# EasyEDA Pro project QV-601-Contril.eprj

# Schematic Schematic1
Board Name: Schematic2; Create Date: 2025-07-12; Page Name: P1; Project Name: QV-601-Contril; Schematic Name: Schematic1; Update Date: 2025-07-12; Company: 嘉立创EDA; Page Size: A4; Version: V1.0
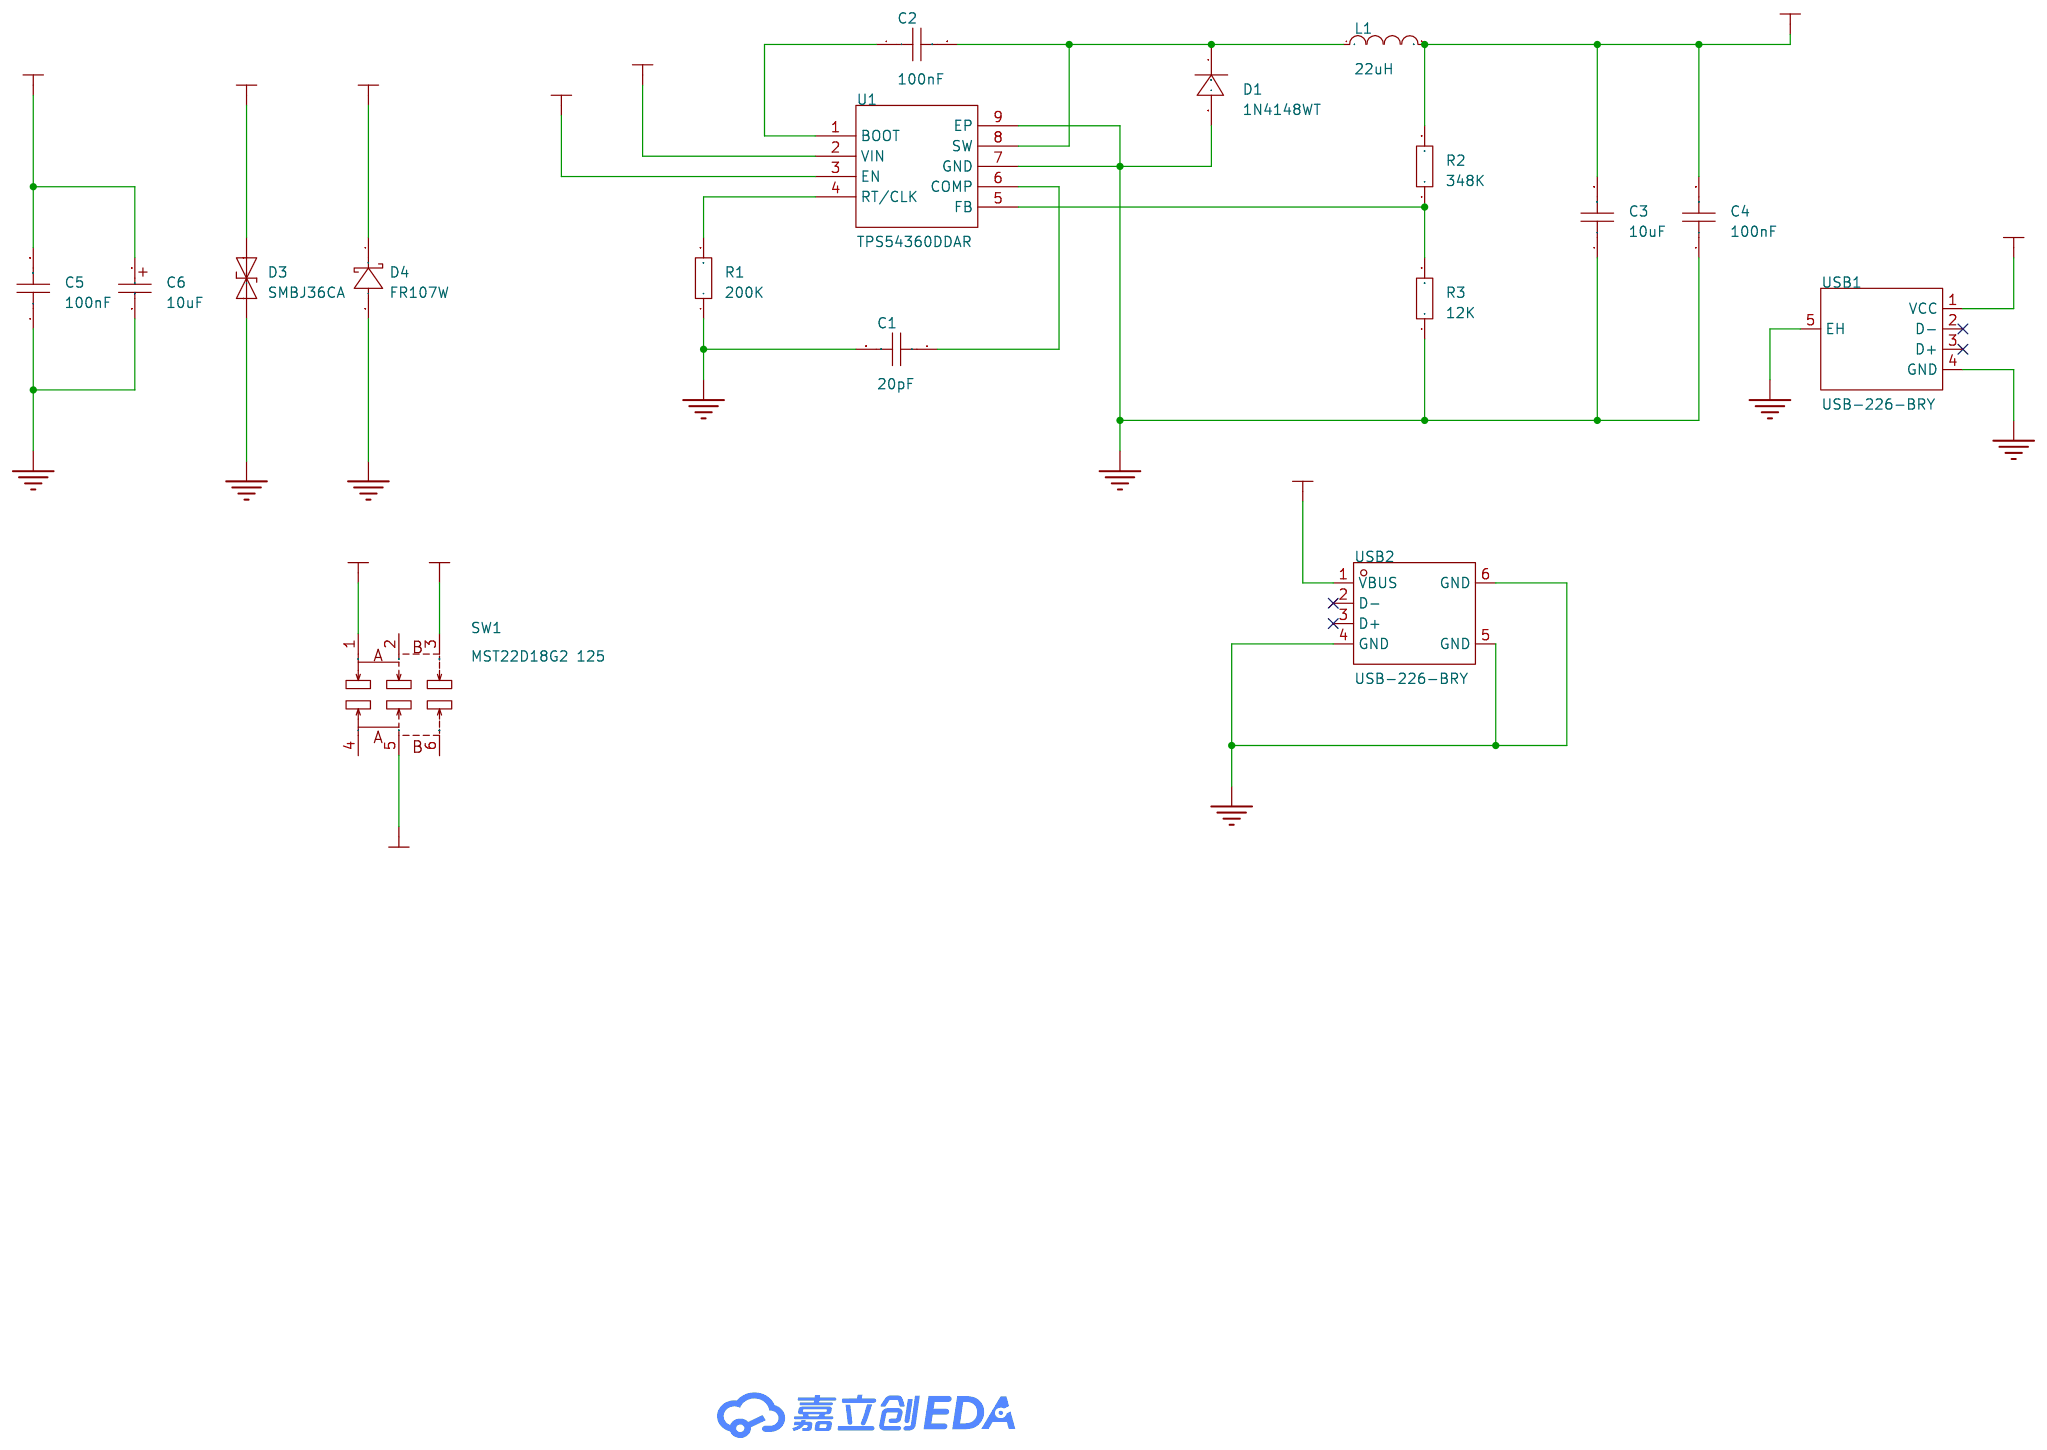
[diagram p0: schematic sheet]

## Parts
C1  20pF  [C0603]
C2  100nF  [C0603]
C3  10uF  [C0603]
C4  100nF  [C0603]
C5  100nF  [C0603]
C6  10uF  [C_Ele_SMD_3x5.4mm]
D1  1N4148WT  [SOD-523_L1.2-W0.8-LS1.6-RD]
D3  SMBJ36CA  [SMB_L4.6-W3.6-LS5.3-BI]
D4  FR107W  [SOD-123FL_L2.7-W1.8-LS3.8-RD]
L1  22uH  [L0603]
R1  200K  [R0603]
R2  348K  [R0603]
R3  12K  [R0603]
SW1  MST22D18G2 125  [SW-SMD_MST22D18G2]
U1  TPS54360DDAR  [SOIC-8_L5.0-W4.0-P1.27-LS6.0-BL-EP2.0]
USB1  USB-226-BRY  [USB-A-TH_USB-226-BRY]
USB2  USB-226-BRY  [USB-A_TH_USB-256-BRWH150]

## Library data of the parts
C1-C5 = CAP_0603: Supplier Footprint: 0603
C6 = C_Ele_SMD_3x5.4mm: Supplier Footprint: SMD,3x5.4mm
D1 = 1N4148WT_C232841: LCSC Part Name: 电压:75V 电流:300mA; Supplier Part: C232841; Manufacturer: onsemi(安森美); Supplier Footprint: SOD-523F; JLCPCB Part Class: 扩展库; Datasheet: https://atta.szlcsc.com/upload/public/pdf/source/20181222/C232841_42C5BA49E5A441BB8F6B91D0F4CD0D51.pdf; Supplier: LCSC; Diode Configuration: 独立式; Forward Voltage (Vf@If): 1V@10mA; Reverse Voltage (Vr): 75V; Rectified Current: 300mA; Reverse Leakage Current: 5uA@75V; Reverse Recovery Time (trr): 4ns; Operating Temperature: -55℃~+150℃@(Tj)
D3 = SMBJ36CA_C83326: Supplier Part: C83326; Manufacturer: Littelfuse(美国力特); Supplier Footprint: SMB(DO-214AA); JLCPCB Part Class: 扩展库; Datasheet: https://atta.szlcsc.com/upload/public/pdf/source/20190807/C409416_D98C874D944FBE9BE31A2BD6B7A21533.pdf; Supplier: LCSC; polarity: 双向; Reverse Stand-Off Voltage (Vrwm): 36V; Maximum Clamping Voltage: 58.1V; Peak Pulse Current (Ipp): 10.4A; Peak Pulse Power Dissipation (Ppp): 600W; Breakdown Voltage: 40V; Type: TVS
D4 = FR107W_C18199114: Supplier Part: C18199114; Manufacturer: 宏嘉诚; Supplier Footprint: SOD-123FL; JLCPCB Part Class: 扩展库; Datasheet: https://atta.szlcsc.com/upload/public/pdf/source/20250116/CFD3D02D7202F2D6A6FEE7AEEDFF5E78.pdf; Supplier: LCSC; Diode Configuration: 独立式; Voltage - Forward(Vf@If): 1.3V@1.0A; Voltage - DC Reverse(Vr): 1kV; Current - Rectified: 1A; Reverse Leakage Current (Ir): 2uA@1000V; Reverse Recovery Time (trr): 500ns; Operating Temperature: -55℃~+150℃
L1 = L_0603
R1-R3 = Res_0603: Supplier Footprint: 0603
SW1 = MST22D18G2 125: LCSC Part Name: 拨动开关/两档立式 6脚贴片 柄长2.0mm 大六立贴 9.1*3.5mm; Supplier Part: C2906280; Manufacturer: SHOU HAN(首韩); Supplier Footprint: SMD; JLCPCB Part Class: 扩展库; Datasheet: https://atta.szlcsc.com/upload/public/pdf/source/20211019/449AD4EDF23AADA7A5C4E3C063EDBB30.pdf; Supplier: LCSC; Circuit: 双刀双掷; Pin Style: 鸥翼型; Mounting Style: 立贴; Actuator Color: 黑色; Current Rating (DC): 100mA; Voltage Rating (DC): 12V; Mechanical Life: 1万次; Operating Temperature: -25℃~+70℃
U1 = TPS54360DDAR: LCSC Part Name: 60V输入、3.5A输出降压DC-DC转换器; Supplier Part: C44377; Manufacturer: TI(德州仪器); Supplier Footprint: SOIC-8-EP; JLCPCB Part Class: 扩展库; Datasheet: https://www.ti.com/cn/lit/gpn/tps54360; Supplier: LCSC; Function: 降压型; Output Type: 可调; Input Voltage: 4.5V~60V; Output Voltage: 800mV~58.8V; Output Current: 3.5A; Switching Frequency: 2.5MHz; Operating Temperature: -40℃~+150℃@(TJ); Synchronous Rectification: 否; Number of Outputs: 1; Topology: 降压式; Switch tube (built-in/external): 内置
USB1 = USB-226-BRY: LCSC Part Name: Type-A 母 侧插; Supplier Part: C720523; Manufacturer: XUNPU(讯普); Supplier Footprint: 插件; JLCPCB Part Class: 扩展库; Datasheet: https://atta.szlcsc.com/upload/public/pdf/source/20250304/9D0DDAB7BEF0F27DF71E5AD865AFBDD8.pdf; Supplier: LCSC; Connector Type: Type-A; Protocol Standard: USB 2.0; Gender: 母; Mounting Type: 侧插; Number of Contacts: 4P; Number of Ports: 1; Current Rating-Power: 1.5A; Operating Temperature: -20℃~+70℃
USB2 = USB-256-BRWH150: LCSC Part Name: Type-A 母 直插; Supplier Part: C720544; Manufacturer: XUNPU(讯普); Supplier Footprint: 插件; JLCPCB Part Class: 扩展库; Datasheet: https://atta.szlcsc.com/upload/public/pdf/source/20200812/C720544_3A01B35EF472B7FB04986893C594DBBE.pdf; Supplier: LCSC; Connector Type: Type-A; Standard: USB 2.0; Gender: 母; Number of Ports: 1; Number of Contacts: 4P; Mounting Style: 直插; Current Rating - Power (Max): 1.5A; Operating Temperature Range: -20℃~+70℃; Soldering Temperature(Max): 260℃

## Nets
GND: C1.2 C3.1 C4.1 C5.1 C6.2 D1.2(A) D3.1(K) D4.2(A) R1.1 R3.1 U1.7(GND) U1.9(EP) USB1.4(GND) USB1.5(EH) USB2.4(GND) USB2.5(GND) USB2.6(GND)
VCC_5V: U1.3(EN) USB1.1(VCC) USB2.1(VBUS)
VCC_24V: C3.2 C4.2 D3.2(A) D4.1(K) L1.2 R2.2 SW1.1 SW1.5
V+: C5.2 C6.1 SW1.3 U1.2(VIN)
$1N372: R1.2 U1.4(RT/CLK)
$1N443: C1.1 U1.6(COMP)
$1N575: C2.1 U1.1(BOOT)
$1N581: C2.2 D1.1(C) L1.1 U1.8(SW)
$1N917: R2.1 R3.2 U1.5(FB)

Not connected (* = marked no-connect by the designer): SW1 2 4 6; USB1 2(D-)* 3(D+)*; USB2 2(D-)* 3(D+)*

# Board QV-601-Contril
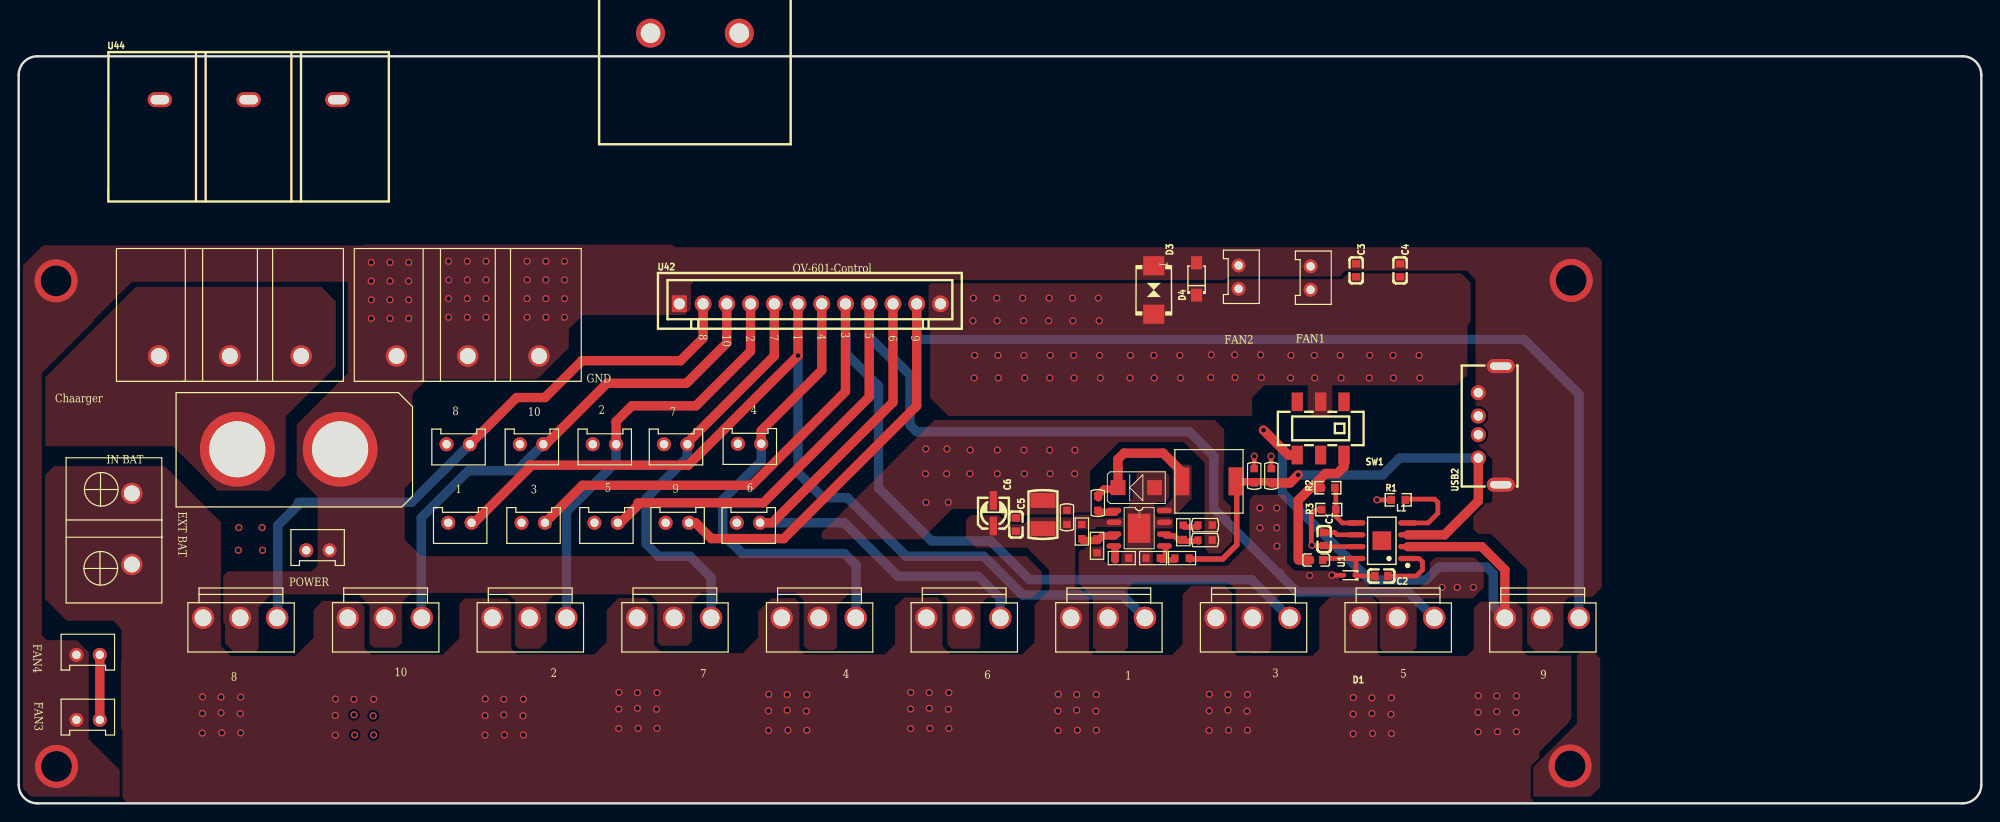
[diagram p1: board, top side]
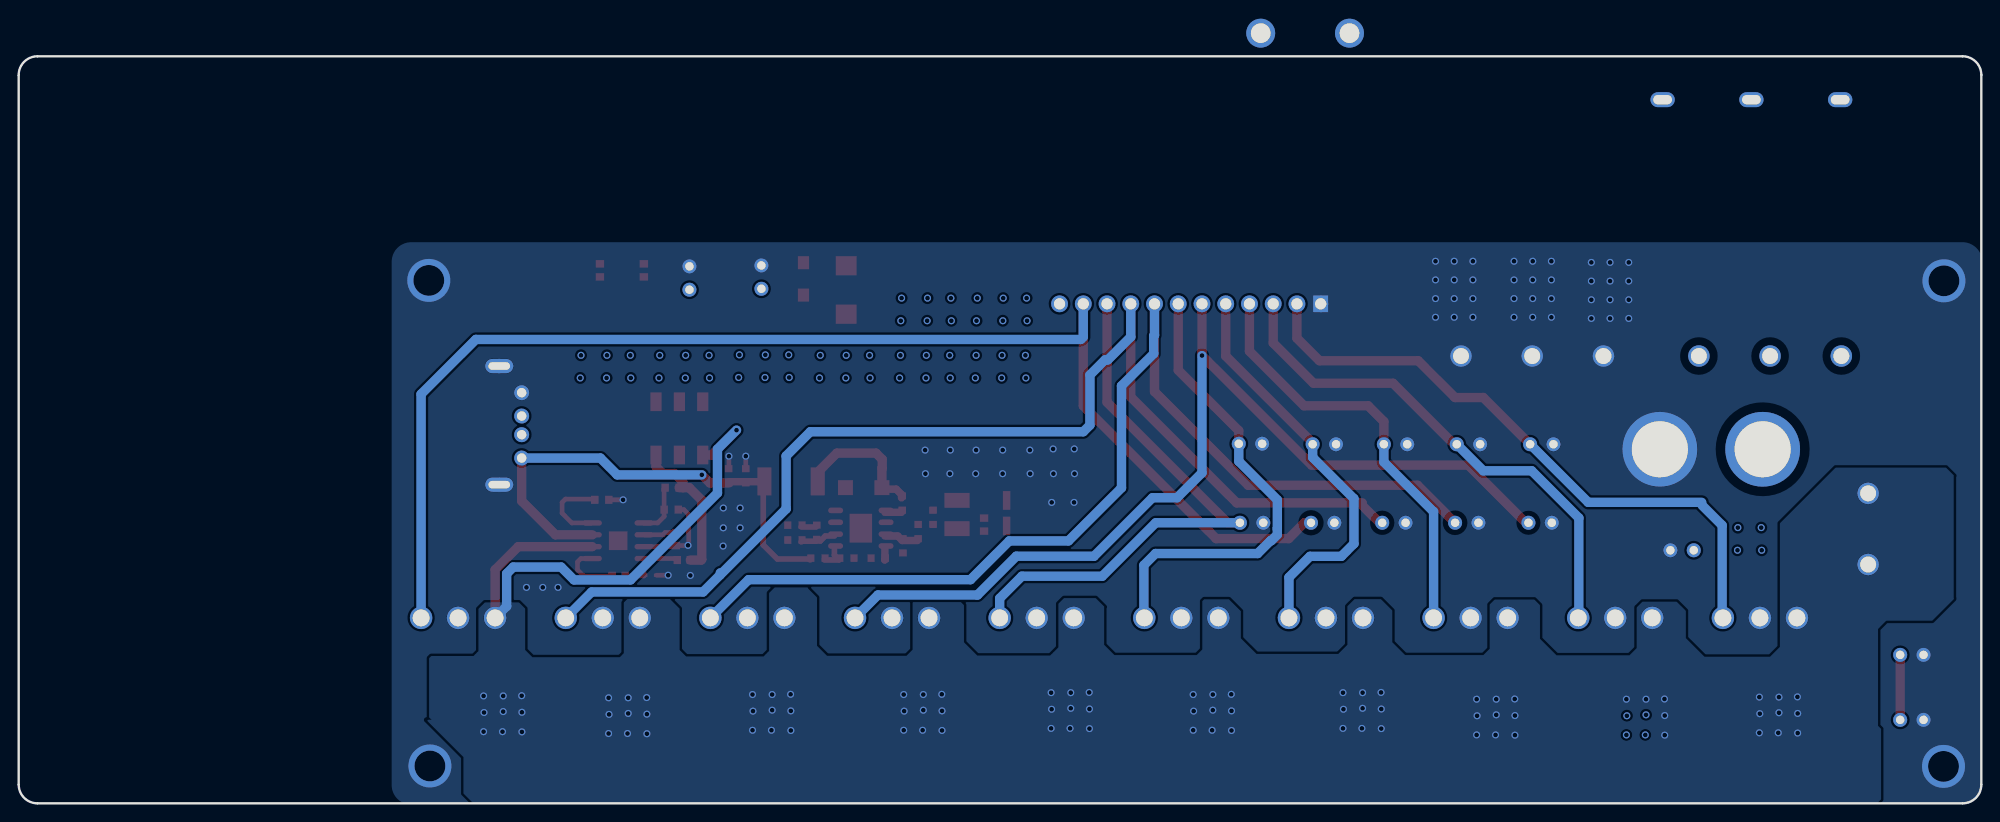
[diagram p2: board, bottom side, seen from below]

Outline 210 x 80 mm; copper layers: Top Layer, Inner1, Inner2, Bottom Layer. Coordinates in mm from the lower left corner of the outline.
Outline path: 0,78 0,2 arc(0.59,0.59) 2,0 208,0 arc(209.41,0.59) 210,2 210,78 arc(209.41,79.41) 208,80 2,80 arc(0.59,79.41) 0,78
Stack: Top Layer 0.035mm 外层铜厚1oz / Dielectric1 0.2104mm 7628 RC49% 8.6mil / Inner1 0.0152mm 内层铜厚 / Dielectric2 1.065mm 1.1mm H/HOZ Copper / Inner2 0.0152mm 内层铜厚 / Dielectric3 0.2104mm 7628 RC49% 8.6mil / Bottom Layer 0.035mm 外层铜厚1oz

## Design rules (mm)
net J1: Top Side Components
net L4: Top Side Components
net R40: Top Side Components
net R38: Top Side Components
net R37: Top Side Components
net R39: Top Side Components
net R36: Top Side Components
net R35: Top Side Components
net D1: Top Side Components
net C56: Top Side Components
net C52: Top Side Components
net C57: Top Side Components
net C54: Top Side Components
net C53: Top Side Components
net C59: Top Side Components
net C58: Top Side Components
net U41: Top Side Components
net U40: Top Side Components
net J9: Top Side Components
net J8: Top Side Components
net J7: Top Side Components
net J6: Top Side Components
net J5: Top Side Components
net J4: Top Side Components
net J3: Top Side Components
net J15: Top Side Components
net J14: Top Side Components
net J13: Top Side Components
net J12: Top Side Components
net J11: Top Side Components
net J10: Top Side Components
net U9: Top Side Components
net U8: Top Side Components
net U7: Top Side Components
net U6: Top Side Components
net U5: Top Side Components
net U12: Top Side Components
net U11: Top Side Components
net U10: Top Side Components
net U2: Top Side Components
net U3: Top Side Components
net U1: Top Side Components
net J2: Top Side Components
net U4: Top Side Components
template: 用户自定义配置
spacing Clearance (default): track to track 0.254, other pairs 0 to 0.254
track width Width (default): min 0.5, default 1, max 2
differential pair DiffPairsRouting (default): width min 0.381, default 0.381, max 0.381; gap min 0.254, default 0.254
via RoutingVias (default): diameter min 0.61, default 0.762, max 4.6; hole min 0.305, default 0.508, max 3.3

## Placement (name value [footprint] x y rotation side)
C1  20pF  [C0603]  139.68 28.3 270 top
C2  100nF  [C0603]  145.8 24.34 180 top
C3  10uF  [C0603]  143.11 57.08 270 top
C4  100nF  [C0603]  147.81 57.08 270 top
C5  100nF  [C0603]  106.7 29.85 270 top
C6  10uF  [C_Ele_SMD_3x5.4mm]  104.31 31.07 270 top
C52  CAP NP_C0603_100NF  [C0603#2]  115.46 32.15 90 top
C53  CAP NP_C0603_10UF/10V  [C0603#2]  134.03 35.08 90 top
C54  CAP NP_C0603_10UF/10V  [C0603#2]  132.2 35.08 90 top
C56  CAP NP_C1210_10UF/50V  [C1210]  109.6 30.93 90 top
C57  CAP NP_C0603_100NF  [C0603#2]  112.16 30.63 90 top
C58  CAP NP_C0603_100NF  [C0603#2]  126.94 28.19 180 top
C59  CAP NP_C0603_100NF  [C0603#2]  126.94 29.79 180 top
D1  1N4148WT  [SMA]  119.58 33.81 180 top
D1#2  -  [SOD-523_L1.2-W0.8-LS1.6-RD]  142.38 24.43 180 top
D3  SMBJ36CA  [SMB_L4.6-W3.6-LS5.3-BI]  121.46 54.98 270 top
D4  FR107W  [SOD-123FL_L2.7-W1.8-LS3.8-RD]  126.03 56.16 90 top
J1  CON2_XT90PBM_XT90PB-M  [XT90PBM]  23.4 37.92 0 top
J2  CON2_DBT50G-7R62-2P1_DBT50G-7.6  [DBT50G-7R62-2P1]  12.11 33.2 270 top
J3  CON2_XH2R54-21_ZX-XH2.54-2PZZ  [XH2R54-21]  8.68 8.94 180 top
J4  CON2_XH2R54-21_ZX-XH2.54-2PZZ  [XH2R54-21]  130.53 55.1 90 top
J5  CON2_XH2R54-21_ZX-XH2.54-2PZZ  [XH2R54-21]  138.23 55 90 top
J6  CON2_XH2R54-21_ZX-XH2.54-2PZZ  [XH2R54-21]  45.78 38.45 0 top
J7  CON2_XH2R54-21_ZX-XH2.54-2PZZ  [XH2R54-21]  53.63 38.45 0 top
J8  CON2_XH2R54-21_ZX-XH2.54-2PZZ  [XH2R54-21]  61.43 38.45 0 top
J9  -  [XH2R54-21]  76.95 38.51 0 top
J9#2  -  [XH2R54-21]  76.83 30.05 0 top
J9#3  -  [XH2R54-21]  69.05 38.45 0 top
J10  CON2_XH2R54-21_ZX-XH2.54-2PZZ  [XH2R54-21]  45.96 30.05 0 top
J11  CON2_XH2R54-21_ZX-XH2.54-2PZZ  [XH2R54-21]  33.27 27.1 180 top
J12  CON2_XH2R54-21_ZX-XH2.54-2PZZ  [XH2R54-21]  53.81 30.05 0 top
J13  CON2_XH2R54-21_ZX-XH2.54-2PZZ  [XH2R54-21]  61.6 30.05 0 top
J14  CON2_XH2R54-21_ZX-XH2.54-2PZZ  [XH2R54-21]  69.22 30.05 0 top
J15  CON2_XH2R54-21_ZX-XH2.54-2PZZ  [XH2R54-21]  8.68 15.9 180 top
L1  22uH  [L0603]  138.83 26.05 180 top
L4  JLSHC0630_3R3M_L0650_CYA0650-22  [L0650]  124.51 34.48 90 top
R1  200K  [R0603]  147.61 32.5 0 top
R2  348K  [R0603]  140.08 33.8 180 top
R3  12K  [R0603]  140.18 31.45 0 top
R35  R2_R0603_42.2K  [R0603#2]  124.48 26.26 0 top
R36  R2_R0603_8K  [R0603#2]  121.38 26.26 0 top
R37  R2_R0603_51K  [R0603#2]  113.76 29.11 90 top
R38  R2_R0603_10K  [R0603#2]  124.61 29.03 270 top
R39  R2_R0603_8K  [R0603#2]  115.39 27.58 90 top
R40  R2_R0603_160K  [R0603#2]  118.03 26.26 180 top
SW1  MST22D18G2 125  [SW-SMD_MST22D18G2]  139.31 40.15 180 top
U1  TPS54360DDAR  [DBT50G-7R62-3P1]  22.6 49 180 top
U1#2  -  [SOIC-8_L5.0-W4.0-P1.27-LS6.0-BL-EP2.0]  145.85 28.12 90 top
U3  CON3_DBT50G-7R62-3P1_DBT50G-7.6  [DBT50G-7R62-3P1]  48.05 49 180 top
U5  CON3_VH3R96-3P1_VH3.96-3P ZZ  [VH3R96-3P1]  147.51 19.86 0 top
U6  CON3_VH3R96-3P1_VH3.96-3P ZZ  [VH3R96-3P1]  23.69 19.86 0 top
U7  CON3_VH3R96-3P1_VH3.96-3P ZZ  [VH3R96-3P1]  39.17 19.86 0 top
U8  CON3_VH3R96-3P1_VH3.96-3P ZZ  [VH3R96-3P1]  54.65 19.86 0 top
U9  CON3_VH3R96-3P1_VH3.96-3P ZZ  [VH3R96-3P1]  70.12 19.86 0 top
U10  CON3_VH3R96-3P1_VH3.96-3P ZZ  [VH3R96-3P1]  116.55 19.86 0 top
U11  CON3_VH3R96-3P1_VH3.96-3P ZZ  [VH3R96-3P1]  132.03 19.86 0 top
U12  -  [VH3R96-3P1]  85.6 19.86 0 top
U12#2  -  [VH3R96-3P1]  101.08 19.86 0 top
U12#3  -  [VH3R96-3P1]  162.98 19.86 0 top
U40  TPS54360BDDAR_SOIC8E_TPS54360BD  [SOIC8E]  119.89 29.46 270 top
U42  ZX-XH2.54-12PZZ  [CONN-TH_12P-P2.54_ZX-XH2.54-12PZZ]  84.66 53.49 0 top
U43  DBT50G-9.5-2P-BK-P OGC  [CONN-TH_2P-P9.50_DBT50G-9.5-2P]  72.35 82.48 0 top
U44  DBT50G-9.5-3P-BK-P OGC  [CONN-TH_3P-P9.50_DBT50G-9.5-3P]  24.6 75.35 0 top
USB2  USB-226-BRY  [USB-A_TH_USB-256-BRWH150]  157.38 40.48 90 top

## Footprints (pads in the part's own frame, mm; a bottom-side part is the same pattern mirrored in y, then rotated)
C0603
  rect 0.8x0.9 smd: 1(-0.7,0) 2(0.7,0)
C0603#2
  rect 0.762x0.813 smd: 1(-0.762,0) 2(0.762,0)
C1210
  rect 1.6x2.7 smd: 1(-1.516,0) 2(1.516,0)
C_Ele_SMD_3x5.4mm
  rect 1.999x0.8 smd: 1(1.374,-0.014) 2(-1.364,-0.014)
CONN-TH_2P-P9.50_DBT50G-9.5-2P
  round 3.1 hole 2.1: 1(-4.75,0) 2(4.75,0)
CONN-TH_3P-P9.50_DBT50G-9.5-3P
  oval 2.6x1.6 hole 2x1: 1(-9.5,0) 2(0,0) 3(9.5,0)
CONN-TH_12P-P2.54_ZX-XH2.54-12PZZ
  rect 1.6x1.8 hole 1.2: 1(-13.97,0)
  round 1.8 hole 1.2: 2(-11.43,0) 3(-8.89,0) 4(-6.35,0) 5(-3.81,0) 6(-1.27,0) 7(1.27,0) 8(3.81,0) 9(6.35,0) 10(8.89,0) 11(11.43,0) 12(13.97,0)
DBT50G-7R62-2P1
  round 2.3 hole 1.7: 1(0,0) 2(7.62,0)
DBT50G-7R62-3P1
  round 2.3 hole 1.7: 1(-7.62,1.1) 2(0,1.1) 3(7.62,1.1)
L0603
  rect 0.8x0.864 smd: 1(-0.7,0) 2(0.7,0)
L0650
  rect 3x1.5 smd: 1(0,0) 2(0,-5.7)
R0603
  rect 0.806x0.864 smd: 1(-0.753,0) 2(0.753,0)
R0603#2
  rect 0.762x0.813 smd: 1(-0.762,0) 2(0.762,0)
SMA
  rect 1.6x1.6 smd: 1(-1.95,0) 2(1.95,0)
SMB_L4.6-W3.6-LS5.3-BI
  rect 2.047x2.241 smd: 1(-2.591,0) 2(2.591,0)
SOD-123FL_L2.7-W1.8-LS3.8-RD
  rect 1.4x1.2 smd: 1(-1.735,0) 2(1.735,0)
SOD-523_L1.2-W0.8-LS1.6-RD
  rect 0.6x0.36 smd: 1(-0.65,0) 2(0.65,0)
SOIC8E
  oval 0.6x1.6 smd: 1(-1.905,-2.7) 2(-0.635,-2.7) 3(0.635,-2.7) 4(1.905,-2.7) 5(1.905,2.7) 6(0.635,2.7) 7(-0.635,2.7) 8(-1.905,2.7)
  rect 3.1x2.4 smd: 9(0,0)
SOIC-8_L5.0-W4.0-P1.27-LS6.0-BL-EP2.0
  oval 0.574x2.038 smd: 1(-1.905,-2.769) 2(-0.635,-2.769) 3(0.635,-2.769) 4(1.905,-2.769) 5(1.905,2.769) 6(0.635,2.769) 7(-0.635,2.769) 8(-1.905,2.769)
  rect 2x2 smd: 9(0,0)
SW-SMD_MST22D18G2
  rect 1.2x2 smd: 1(-2.5,2.85) 2(0,2.85) 3(2.5,2.85) 4(-2.5,-2.85) 5(0,-2.85) 6(2.5,-2.85)
USB-A_TH_USB-256-BRWH150
  round 1.6 hole 1: 1(-3.5,1.2) 2(-1,1.2) 3(1,1.2) 4(3.5,1.2)
  oval 1.524x3 hole 0.8x2.3: 5(-6.35,-1.2) 6(6.35,-1.2)
VH3R96-3P1
  round 2.4 hole 1.8: 1(-3.96,0) 2(0,0) 3(3.96,0)
XH2R54-21
  round 1.5 hole 0.9: 1(0,0) 2(2.5,0)
XT90PBM
  round 8 hole 6: 1(0,0) 2(11,0)

## Nets
GND: C1.2 C3.1 C4.1 C5.1 C6.2 C53.2 C54.2 C56.2 C57.2 C58.1 C59.1 D1.1 D1#2.2 D3.1 D4.2 J1.2 J3.2 J4.2 J5.2 J6.1 J7.1 J8.1 J9.1 J9#2.1 J9#3.1 J10.1 J11.1 J12.1 J13.1 J14.1 J15.2 R1.1 R3.1 R36.1 R39.1 R40.1 U1#2.7 U1#2.9 U3.1 U3.2 U3.3 U5.2 U6.2 U7.2 U8.2 U9.2 U10.2 U11.2 U12.2 U12#2.2 U12#3.2 U40.7 U40.9 U42.1 USB2.4 USB2.5 USB2.6
VCC_5V: C53.1 C54.1 L4.2 R35.2 U1#2.3 USB2.1
VCC_24V: C3.2 C4.2 D3.2 D4.1 J3.1 J4.1 J5.1 J11.2 J15.1 L1.2 R2.2 SW1.1 SW1.5 U42.12
1.2: J8.2 U8.3 U42.4
1.4: J10.2 U10.3 U42.6
1.5: J9#3.2 U9.3 U42.5
1.6: J9.2 U12.3 U42.7
2.4: J14.2 U12#3.3 U42.11
2.8: J9#2.2 U12#2.3 U42.10
5.2: J12.2 U11.3 U42.8
5.8: J6.2 U6.3 U42.2
433: J13.2 U5.3 U42.9
900: J7.2 U7.3 U42.3
V+: C5.2 C6.1 C56.1 C57.1 J2.1 J2.2 R37.2 SW1.3 U1#2.2 U5.1 U6.1 U7.1 U8.1 U9.1 U10.1 U11.1 U12.1 U12#2.1 U12#3.1 U40.2
$1N372: R1.2 U1#2.4
$1N443: C1.1 U1#2.6
$1N575: C2.1 U1#2.1
$1N581: C2.2 D1#2.1 L1.1 U1#2.8
$1N917: R2.1 R3.2 U1#2.5
N41242: J1.1 U1.1 U1.2 U1.3
N62769: R37.1 R39.2 U40.3
N62809: R40.2 U40.4
N62825: C52.1 U40.1
N62837: C52.2 D1.2 L4.1 U40.8
N62937: C58.2 R38.2 U40.6
N62993: C59.2 R38.1
N63043: R35.1 R36.2 U40.5

Pads without a net: SW1 2 4 6; U43 1 2; U44 1 2 3; USB2 2 3

## Via types
v1: diameter 0.762, hole 0.508, Top Layer to Bottom Layer, 211 vias
v2: diameter 4.6, hole 3.3, Top Layer to Bottom Layer, 4 vias

## Routing (per net, layer and track width the routed paths; a pad name or vN(x,y) marks a point on that pad's centre or on a via; arc(x,y) is an arc through that point)
GND: length 14.9
  Top Layer w0.5: 134,35.84 v1(134,37.18) ; 143.11,27.48 139.8,27.48 C1.2 138.41,27.6 v1(138.38,27.63) 138.31,27.7 138.31,30.93 138.83,31.45 R3.1 ; C54.2 v1(132.2,37.18) ; R1.1 v1(145.33,32.5) ; D1#2.2 v1(140.51,24.43)
  vias: v1(35.88,9.48) v1(35.95,7.33) v1(37.73,57.93) v1(37.73,55.93) v1(37.73,53.93) v1(37.73,51.93) v1(37.93,9.38) v1(37.98,7.33) v1(39.73,57.93) v1(39.73,55.93) v1(39.73,53.93) v1(39.73,51.93) v1(41.73,57.93) v1(41.73,55.93) v1(41.73,53.93) v1(41.73,51.93) v1(46,58.05) v1(46,56.05) v1(46,54.05) v1(46,52.05) v1(48,58.05) v1(48,56.05) v1(48,54.05) v1(48,52.05) v1(50,58.05) v1(50,56.05) v1(50,54.05) v1(50,52.05) v1(54.4,58.05) v1(54.4,56.05) v1(54.4,54.05) v1(54.4,52.05) v1(56.4,58.05) v1(56.4,56.05) v1(56.4,54.05) v1(56.4,52.05) v1(58.4,58.05) v1(58.4,56.05) v1(58.4,54.05) v1(58.4,52.05) v1(97.03,35.3) v1(97.05,37.95) v1(97.08,32.23) v1(99.32,37.95) v1(99.28,35.3) v1(99.47,32.23) v1(101.8,37.83) v1(101.77,35.3) v1(104.71,37.83) v1(104.72,35.3) v1(107.56,37.83) v1(107.6,35.3) v1(110.32,37.83) v1(110.36,35.3) v1(113.02,37.83) v1(112.98,35.3) v1(132.81,31.63) v1(132.81,29.5) v1(134.61,31.63) v1(134.61,29.5) v1(134.63,27.55) v1(138.13,24.4) v1(152.29,23.12) v1(153.93,23.12) v1(155.67,23.12) v2(4,55.95) v2(4.05,3.95) v2(166,4) v2(166.12,56)
VCC_5V: length 52.9
  Top Layer w0.6: 130.33,34.27 130.33,27.67 128.82,26.16 125.42,26.16 125.32,26.06
  Top Layer w0.8: 130.54,34.44 134,34.44 ; 130.33,34.27 130.49,34.12
  Top Layer w1: C53.1 136.04,34.31 v1(136.91,35.18) ; U1#2.3 152.56,28.75 156.18,32.38 USB2.1
  Bottom Layer w1: v1(136.91,35.18) 145.96,35.18 147.76,36.98 USB2.1
VCC_24V: length 22.9
  Top Layer w1: L1.2 136.98,26.05 136.91,26.13 136.91,32.45 138.26,33.8 138.94,33.8 ; J15.1 J3.1 ; 138.94,33.8 138.94,34.44 139.83,35.33 141.08,35.33 141.81,36.05 SW1.1 ; 138.94,33.8 R2.2
  vias: v1(23.5,27.1) v1(23.55,29.53) v1(26.05,29.53) v1(26.09,27.1) v1(102.11,51.68) v1(102.16,54.1) v1(102.23,45.55) v1(102.28,47.98) v1(104.66,54.1) v1(104.7,51.68) v1(104.78,47.98) v1(104.82,45.55) v1(107.43,54.1) v1(107.51,51.68) v1(107.55,47.98) v1(107.64,45.55) v1(110.2,51.68) v1(110.26,54.1) v1(110.33,45.55) v1(110.38,47.98) v1(112.76,54.1) v1(112.8,51.68) v1(112.88,47.98) v1(112.92,45.55) v1(115.53,54.1) v1(115.61,51.68) v1(115.66,47.98) v1(115.74,45.55) v1(118.91,45.55) v1(118.96,47.98) v1(121.46,47.98) v1(121.5,45.55) v1(124.23,47.98) v1(124.32,45.55) v1(127.61,48.03) v1(127.56,45.6) v1(130.11,48.03) v1(130.15,45.6) v1(132.88,48.03) v1(132.97,45.6) v1(136.13,47.98) v1(136.08,45.55) v1(138.63,47.98) v1(138.67,45.55) v1(141.41,47.98) v1(141.49,45.55) v1(144.51,45.55) v1(144.56,47.98) v1(147.06,47.98) v1(147.1,45.55) v1(149.83,47.98) v1(149.92,45.55)
1.2: length 45.8
  Top Layer w1: U42.4 78.31,48.41 72.47,42.57 65.61,42.57 63.93,40.89 J8.2
  Bottom Layer w1: J8.2 63.93,36.55 58.61,31.23 U8.3
1.4: length 104
  Top Layer w1: 54.63,36.22 71.65,36.22 v1(83.39,47.95) U42.6 ; 54.71,36.02 48.53,29.85
  Bottom Layer w1: U10.3 118.07,22.31 107.41,22.31 103.26,26.46 94.94,26.46 88.68,32.73 86.05,32.73 83.39,35.39 v1(83.39,47.95)
1.5: length 44.2
  Top Layer w1: J9#3.2 71.55,38.6 80.85,47.9 U42.5
  Bottom Layer w1: J9#3.2 71.55,37.04 67.13,32.63 67.13,27.8 68.48,26.45 71.83,26.45 74.08,24.2 U9.3
1.6: length 50.4
  Top Layer w1: U42.7 85.93,46.38 79.45,39.9 J9.2
  Bottom Layer w1: J9.2 79.45,36.62 75.32,32.5 75.32,29.42 75.33,29.42 75.33,28.77 75.97,28.13 76.05,28.13 77.43,26.75 88.35,26.75 89.6,25.5 89.6,19.91 U12.3
2.4: length 142.8
  Top Layer w1: U42.11 96.09,42.57 81.86,28.35 74.12,28.35 72.42,30.05 J14.2
  Bottom Layer w1: U12#3.3 166.94,43.82 161.08,49.68 96.35,49.68 96.09,49.94 U42.11
2.8: length 61.3
  Top Layer w1: U42.10 93.55,42.95 80.64,30.05 J9#2.2
  Bottom Layer w1: J9#2.2 88.33,30.05 94.05,24.33 102.66,24.33 105.04,21.94 U12#2.3
5.2: length 118.3
  Top Layer w1: U42.8 88.47,44.09 78.44,34.06 60.32,34.06 J12.2
  Bottom Layer w1: U11.3 131.9,23.95 108.16,23.95 104.01,28.1 97.68,28.1 92,33.78 92,44.71 88.55,48.15 88.55,50.05 88.47,50.14 U42.8
5.8: length 67.5
  Top Layer w1: U42.2 73.23,49.81 70.81,47.4 60.25,47.4 56.32,43.46 53.29,43.46 J6.2
  Bottom Layer w1: 29.87,31.91 27.73,29.77 27.73,19.66 ; J6.2 42.06,32.23 29.92,32.23 ; 48.41,38.45 48.41,38.58
433: length 125.1
  Top Layer w1: 66.19,31.85 64.18,29.85 ; 66.24,32.18 79.67,32.18 91.01,43.51 U42.9
  Bottom Layer w1: U5.3 148.69,22.64 136.77,22.64 134.93,24.48 134.93,24.68 ; U42.9 91.01,49.95 93.47,47.48 93.76,47.48 95.38,45.87 95.38,40.5 96.09,39.79 125.29,39.79 127.88,37.2 127.88,31.53 134.73,24.68
900: length 55.5
  Top Layer w1: J7.2 56.41,38.45 62.94,44.98 71.45,44.98 75.77,49.3 U42.3
  Bottom Layer w1: 56.25,38.45 56.25,38.58 ; U7.3 43.06,19.93 43.06,30.56 48.11,35.61 53.28,35.61 J7.2
V+: length 61.4
  Top Layer w1: v1(133.19,39.96) 135.86,37.3 SW1.3 ; U1#2.2 156.55,27.48 159.02,25.01 159.02,19.86
  Bottom Layer w1: v1(133.19,39.96) 135.23,37.93 135.23,33.23 144.53,23.93 150.58,23.93 151.96,25.3 157.08,25.3 157.79,24.59 157.79,21.09 159.02,19.86
  vias: v1(19.68,11.4) v1(19.65,9.63) v1(19.65,7.53) v1(21.65,11.38) v1(21.65,9.7) v1(21.73,7.55) v1(23.7,9.6) v1(23.75,11.38) v1(23.75,7.55) v1(33.9,11.18) v1(33.88,9.4) v1(33.88,7.3) v1(35.88,11.15) v1(37.98,11.15) v1(49.93,11.18) v1(49.9,9.4) v1(49.9,7.3) v1(51.9,11.15) v1(51.9,9.48) v1(51.98,7.33) v1(54,11.15) v1(53.95,9.38) v1(54,7.33) v1(64.23,11.88) v1(64.2,10.1) v1(64.2,8) v1(66.2,11.85) v1(66.2,10.18) v1(66.28,8.03) v1(68.3,11.85) v1(68.25,10.08) v1(68.3,8.03) v1(80.23,9.9) v1(80.23,7.8) v1(80.25,11.68) v1(82.23,11.65) v1(82.23,9.98) v1(82.3,7.83) v1(84.33,11.65) v1(84.28,9.88) v1(84.33,7.83) v1(95.43,10.1) v1(95.43,8) v1(95.45,11.88) v1(97.43,11.85) v1(97.43,10.18) v1(97.5,8.03) v1(99.53,11.85) v1(99.48,10.08) v1(99.53,8.03) v1(111.23,11.68) v1(111.2,9.9) v1(111.2,7.8) v1(113.21,11.65) v1(113.21,9.98) v1(113.28,7.83) v1(115.31,11.65) v1(115.26,9.88) v1(115.31,7.83) v1(127.41,11.68) v1(127.38,9.9) v1(127.38,7.8) v1(129.38,11.65) v1(129.38,9.98) v1(129.46,7.83) v1(131.43,9.88) v1(131.48,11.65) v1(131.48,7.83) v1(142.81,11.33) v1(142.78,9.55) v1(142.78,7.45) v1(144.78,11.3) v1(144.78,9.63) v1(144.86,7.48) v1(146.83,9.53) v1(146.88,11.3) v1(146.88,7.48) v1(156.18,11.53) v1(156.16,9.75) v1(156.16,7.65) v1(158.16,11.5) v1(158.16,9.83) v1(158.23,7.68) v1(160.21,9.73) v1(160.26,11.5) v1(160.26,7.68)
$1N372: length 8.4
  Top Layer w0.5: 148.7,30.02 150.81,30.02 151.86,31.08 151.86,32.23 151.5,32.58 148.44,32.58 R1.2
$1N443: length 3.5
  Top Layer w0.5: U1#2.6 141.08,28.75 140.83,29 C1.1
$1N575: length 6.6
  Top Layer w0.5: C2.1 149.55,24.34 150.21,25 150.21,25.85 149.84,26.21 U1#2.1
$1N581: length 7.4
  Top Layer w0.5: C2.2 143.11,24.34 D1#2.1 143.09,24.48 U1#2.8 139.82,26.21 139.66,26.05
$1N917: length 5.6
  Top Layer w0.5: U1#2.5 141.63,30.02 140.94,30.72 R3.2 140.94,33.7 R2.1
N62769: length 3.7
  Top Layer w0.8: 113.84,28.15 115.46,28.15 115.95,28.63 117.32,28.63
N62809: length 1.3
  Top Layer w0.8: 117.34,26.06 117.32,26.09 117.32,27.36
N62825: length 1.8
  Top Layer w0.8: 115.54,31.19 115.57,31.17 117.32,31.17
N62837: length 14.7
  Top Layer w0.8: 115.54,32.72 115.54,33.07 116.11,33.64 117.58,33.64
  Top Layer w1: 124.56,34.47 124.56,35.4 122.46,37.5 118.27,37.5 117.61,36.84 117.61,35.9 117.63,35.88 D1.2
N62937: length 3.8
  Top Layer w0.6: 126.26,27.99 126.18,28.07 124.68,28.07 124.66,28.1 124.23,28.1 123.69,28.63 122.72,28.63
N62993: length 1.6
  Top Layer w0.6: 124.68,29.59 126.26,29.59
N63043: length 3.1
  Top Layer w0.6: 123.79,26.06 122.22,26.06 122.72,26.56 122.72,27.36

## Copper pours and planes (outline as drawn; the poured copper is in the pictures)
GND on Top Layer: 6.82,1.91 6.82,7.4 7.34,6.88 7.5,6.88 10.8,3.58 10.8,0.7 7.5,0.7 7.43,0.77 7.43,1.3
GND on Top Layer: 62.4,59.63 62.4,53 62.98,52.43 71.45,52.43 71.93,52.9 71.93,55.53 72.43,56.03 129.04,56.03 129.41,56.41 141.34,56.41 141.98,57.05 154.93,57.05 155.88,56.1 155.88,38.64 157.66,36.86 157.66,32.36 157.46,32.15 156.01,32.15 155.63,31.78 155.63,29.38 156.16,28.85 157.56,28.85 161.41,25 161.41,17.13 162.34,16.2 164.61,16.2 165.28,16.88 165.28,21.48 165.88,22.08 168.36,22.08 169.38,23.1 169.38,58.15 167.98,59.55 70.03,59.55 69.85,59.73 68.95,59.73 68.85,59.63
GND on Top Layer: 1.3,0.72 8,0.72 7.5,1.23 7.5,16.2 6.25,17.45 5.05,17.45 5.03,17.48 3,17.48 2.48,18 2.48,46.08 8.08,51.68 8.08,51.8 12.13,55.85 35.23,55.85 35.65,55.43 35.65,46.98 37.23,45.4 55.23,45.4 58.63,48.8 58.63,50.73 60.35,52.45 71.1,52.45 71.18,52.38 71.81,53 71.81,57.85 71.83,57.88 69.95,59.75 2.6,59.75 0.45,57.6 0.45,1.57
GND on Top Layer: 127.07,27.16 127.21,27.03 128.58,27.03 129.73,28.18 129.73,31.75 128.91,32.58 128.91,36.13 128.88,36.15 129.01,36.15 129.01,40.03 127.98,41.05 97.98,41.05 85.93,29 85.93,28.28 96.63,28.28 99.88,31.53 103.4,31.53 103.66,31.27 104.86,31.27 106,30.13 107.02,30.13 107.81,30.93 111.6,30.93 111.63,30.9 112.73,30.9 112.86,31.03 114.46,31.03 114.63,31.2 114.63,35.58 117.74,38.69 124.67,38.69 126.88,36.48 126.88,27.35
GND on Top Layer: 127.27,26.87 127.27,30.2 129.75,30.2 129.75,28.08 128.54,26.87
GND on Top Layer: 119.58,35.2 119.58,34.51 119.18,34.1 119.18,32.7 118.88,32.41 118.88,32.01 118.53,31.66 118.53,27.7 118.78,27.45 121.11,27.45 121.41,27.75 121.41,29.28 121.56,29.43 123.41,29.43 123.53,29.55 123.53,30.43 123.31,30.65 121.79,30.65 121.49,30.95 121.49,31.99 121.78,32.28 122.66,32.28 123.13,32.75 123.13,35.08 122.58,35.63 122.58,35.65 120.03,35.65
GND on Top Layer: 22.08,19.18 22.08,17.15 23.02,16.2 25.3,16.2 25.68,16.58 25.68,21.03 27.03,22.38 36.35,22.38 37.55,21.18 37.55,17.08 37.95,16.68 40.5,16.68 41.03,17.2 41.03,21.53 42.03,22.53 52.28,22.53 53.1,21.7 53.1,16.95 53.5,16.55 55.75,16.55 56.5,17.3 56.5,21.52 57.36,22.38 67.5,22.38 68.33,21.55 68.33,17.28 68.73,16.88 71.58,16.88 72.05,17.35 72.05,21.55 73.05,22.55 83.18,22.55 84,21.73 84,16.9 84.5,16.4 87.25,16.4 87.54,16.69 87.54,21.16 88.9,22.53 98.65,22.53 99.35,21.83 99.35,17.03 99.83,16.55 102.68,16.55 102.91,16.78 102.91,21.27 103.62,21.98 108.44,21.98 109.46,23 109.48,23 109.46,23.02 109.46,24.82 107.82,26.46 43.09,26.46 41.3,28.25 41.3,43.05 44.18,45.93 55.63,45.93 58.75,49.05 58.8,49.05 58.8,50.91 60.19,52.3 71.31,52.3 71.85,52.85 71.85,57.9 71.6,57.9 69.8,59.7 36.98,59.7 36.93,59.75 35.3,58.13 35.3,46.05 29.88,40.63 29.88,34.93 31.99,32.82 31.99,25.47 31.36,24.85 22.35,24.85 21.93,24.43 21.88,24.43 21.88,19.38
GND on Top Layer: 141.27,24.43 141.27,23.86 143.9,23.86 144.61,23.15 150.01,23.15 151.01,24.15 151.01,25.78 151.58,26.35 155.76,26.35 156.66,25.45 156.76,25.45 156.76,23.1 155.58,21.93 150.33,21.93 149.61,21.2 149.58,21.2 149.58,16.73 149.13,16.28 146.11,16.28 146.06,16.23 145.66,16.63 145.66,21.59 144.87,22.38 135.08,22.38 134.03,21.33 134.03,16.5 133.61,16.08 131.91,16.08 131.78,16.2 130.48,16.2 130.23,16.45 130.23,22.85 129.38,23.7 119.33,23.7 118.69,23.06 118.69,16.68 118.21,16.2 115.48,16.2 114.96,16.73 114.96,22.03 113.41,23.58 113.41,26.9 113.68,27.18 113.99,27.18 114.47,27.66 115.79,27.66 116.1,27.35 116.1,26.03 116.58,25.55 117.88,25.55 118.03,25.7 118.03,26.72 118.28,26.97 121.26,26.97 121.36,26.88 121.36,25.63 121.53,25.45 129.36,25.45 131.71,27.8 131.71,32.55 132.18,33.03 135.43,33.03 135.71,32.75 135.71,25.73 136.53,24.9 140.79,24.9
GND on Top Layer: 162.06,3.88 162.06,0.72 168.18,0.72 169.23,1.77 169.23,15.53 168.56,16.2 166.97,16.2 166.97,16.04 166.73,15.8 166.73,8.55
GND on Top Layer: 29.75,40.58 29.75,35.13 31.43,33.45 41.01,33.45 42.14,34.59 42.14,43.89 43.73,45.48 55.58,45.48 58.85,48.75 58.85,50.78 60.38,52.3 71.25,52.3 71.88,52.93 71.88,57.88 69.9,59.85 36.88,59.85 35.2,58.18 35.2,46.03
GND on Top Layer: 118.56,27.29 118.03,26.76 118.03,24.33 118.36,24 121.13,24 121.23,24.1 121.23,29.05 121.38,29.2 118.78,29.2 118.53,28.95 118.56,28.93
GND on Bottom Layer: 8.81,0.47 8.87,0.4 2.12,0.4 0.65,1.88 0.65,58.05 2.28,59.68 168.01,59.68 169.46,58.23 169.46,51.93 168.83,51.3 156.51,51.3 156.08,51.73 156.08,56.13 155.13,57.08 142.16,57.08 141.51,56.43 129.58,56.43 129.21,56.05 72.6,56.05 71.83,55.28 71.83,52.65 71.55,52.38 68.4,52.38 68.35,52.33 60.53,52.33 59.28,51.08 59.28,49.08 55.63,45.43 43.9,45.43 42.3,43.83 42.3,34.88 41.23,33.8 31.48,33.8 30.38,34.9 30.38,41 35.35,45.98 35.35,55.7 35.13,55.93 12.25,55.93 2.5,46.18 2.5,19.58 4.03,18.05 5.93,18.05 7.55,16.43 7.55,6.58 8.81,5.32
GND on Bottom Layer: -20.35,49.8 -1.2,68.95 -1.2,76.28 173.48,76.28 187.18,62.58 187.18,-11.43 186.01,-12.6 -14.23,-12.6 -18.48,-8.35 -18.48,47.93
GND on Bottom Layer: 167.93,0.4 162.53,0.4 166.96,4.83 166.96,15.8 167.23,16.08 168.71,16.08 169.31,15.48 169.31,1.77
GND on Inner1: -7.65,58.7 -7.65,3.8 -1.7,-2.15 171.16,-2.15 175.18,1.88 175.18,61.73 171.73,65.18 -1.18,65.18
GND on Inner2: -3.68,59.93 -3.68,0.85 2.58,-5.4 174.46,-5.4 182.18,2.32 182.18,61.23 175.96,67.45 4.09,67.45 -3.44,59.93
VCC_24V on Top Layer: 153.89,44.78 155.01,45.89 155.01,55.78 154.28,56.5 142.38,56.5 142.28,56.6 141.66,55.98 129.76,55.98 129.71,56.03 129.31,55.63 97.73,55.63 97.53,55.43 97.5,55.43 97.5,51.5 97.53,51.48 97.53,43.43 99.48,41.48 131.98,41.48 131.98,43.45 133.31,44.78
VCC_24V on Top Layer: 97.92,56.03 97.36,55.47 97.36,51.33 119.3,51.33 119.78,50.85 154.68,50.85 155.36,51.53 155.36,55.75 154.38,56.73 154.38,56.75 142.23,56.75 141.61,56.13 129.61,56.13 129.18,55.7 97.59,55.7 97.92,56.03
VCC_24V on Top Layer: 137.93,44.9 137.93,42.04 138.49,41.48 140.09,41.48 140.56,41.95 140.56,46.05 140.28,46.33 138.28,46.33 137.96,46 137.96,44.93
VCC_24V on Inner2: 7.4,6.85 8.1,6.15 14.25,6.15 15.23,7.13 15.23,20.14 13.9,21.46 6.59,21.46 5.07,22.98 5.07,45.33 10.7,50.95 58.4,50.95 60.28,49.08 60.28,45.51 60.81,44.98 60.81,42.97 61.5,42.28 98.9,42.28 99.45,41.73 153.13,41.73 154.96,43.55 154.43,44.08 154.43,55.08 130.28,55.08 129.51,55.85 129.03,55.38 98.98,55.38 98.85,55.5 98.8,55.45 97.8,55.45 97.53,55.18 97.53,52.23 97.36,52.06 97.36,51.03 66.72,51.03 65.43,52.33 65.43,57.53 64.33,58.63 12.17,58.63 0.75,47.21 0.75,21.83 4.1,18.48 5.86,18.48 7.4,16.94
VCC_24V on Inner2: 31.03,33.28 17.58,33.28 16.05,31.74 16.05,22.05 15.23,21.23 9.2,21.23 6.58,18.6 7.4,17.78 7.4,6.98 7.95,6.43 14.23,6.43 14.2,6.4 14.2,6.28 16.75,6.28 17.18,6.7 17.18,21.2 18.13,22.15 31.55,22.15 31.83,22.43 31.83,25.25 31.95,25.38 31.95,32.35
V+ on Top Layer: 5.15,19.55 2.8,21.9 2.8,35.08 2.78,35.1 3.78,36.1 15.65,36.1 21.65,30.1 21.65,16.8 22.68,15.78 29.6,15.78 31.55,17.73 31.55,20.7 32.53,21.68 36.35,21.68 37,21.03 37,16.63 37.7,15.93 45.4,15.93 47.15,17.68 47.15,21.35 47.75,21.95 52.25,21.95 52.71,21.49 52.71,16.57 53.33,15.95 61.6,15.95 62.93,17.28 62.93,20.73 64.18,21.98 67.1,21.98 67.98,21.1 67.98,16.95 68.85,16.08 77.45,16.08 79.13,17.75 79.13,20.55 80.56,21.98 83.05,21.98 83.54,21.49 83.54,16.47 84.05,15.95 92.68,15.95 93.75,17.03 93.75,21.05 94.75,22.05 98.28,22.05 98.84,21.49 98.84,16.81 99.7,15.95 107.41,15.95 108.71,17.25 108.71,21.25 110.53,23.08 113.18,23.08 113.31,23.2 114.52,21.99 114.52,16.39 115.01,15.9 123.41,15.9 124.53,17.03 124.53,22.33 125.51,23.3 129.06,23.3 129.83,22.53 129.83,16.35 130.38,15.8 138.46,15.8 139.16,16.5 139.16,20.93 140.48,22.25 144.63,22.25 145.39,21.49 145.39,16.09 145.71,15.78 154.96,15.78 155.71,16.53 155.71,20.9 156.41,21.6 160.13,21.6 160.91,20.83 160.91,16.35 161.43,15.83 166.15,15.83 166.15,9.11 161.51,4.48 14.48,4.48 11,7.95 11,18.6 10.14,19.55
V+ on Top Layer: 101.35,28.48 102.45,27.38 108.01,27.38 108.16,27.23 110.94,27.23 113.05,29.34 115.09,29.34 115.34,29.59 118.12,29.59 118.26,29.73 118.26,30.33 118.36,30.43 118.16,30.63 116.43,30.63 116.41,30.6 116.41,30.65 116.26,30.5 114.91,30.5 114.51,30.9 113.14,30.9 112.87,30.63 108.26,30.63 107.55,29.93 105.88,29.93 105.86,29.9 104.91,30.85 101.91,30.85 101.35,30.3
V+ on Top Layer: 11.1,7.88 11.1,0.57 11.53,0.15 161.93,0.15 162.71,0.92 162.71,5.53 165.88,8.7 165.88,15.78 11.5,15.78 10.95,15.23 10.95,8.03
V+ on Top Layer: 110.36,21 110.36,25.02 108.12,27.25 108.12,30.33 112.95,30.33 112.95,20.75 113,20.7 113,20.32 111.04,20.32
V+ on Bottom Layer: 10.73,7.98 10.73,0.42 11.19,-0.05 161.31,-0.05 162.41,1.05 162.41,4.95 166.38,8.93 166.38,8.95 11.7,8.95
V+ on Bottom Layer: 98.15,21.98 98.75,21.38 98.75,16.7 99.63,15.83 107.43,15.83 108.86,17.25 108.86,21.23 110.48,22.85 113.46,22.85 114.36,21.95 114.36,16.45 115.01,15.8 123.51,15.8 124.58,16.88 124.58,22.05 125.53,23 125.53,23.13 129.11,23.13 129.71,22.53 129.71,16.33 130.31,15.73 138.58,15.73 139.28,16.43 139.28,20.85 140.46,22.03 140.46,22.1 144.66,22.1 145.26,21.5 145.26,16.08 145.68,15.65 155.03,15.65 155.81,16.43 155.81,20.85 156.47,21.52 160.12,21.52 160.81,20.83 160.81,16.3 161.33,15.78 165.86,15.78 166.08,15.55 166.08,9.2 161.48,4.6 14.4,4.6 11.05,7.95 11.05,18.67 10.17,19.55 5.25,19.55 2.93,21.88 2.93,21.98 2.95,21.98 2.95,35.03 2.9,35.08 3.78,35.95 15.59,35.95 21.54,30 21.55,30 21.55,16.75 22.6,15.7 29.62,15.7 31.62,17.7 31.62,20.62 32.59,21.59 36.26,21.59 36.85,21 36.88,21 36.88,16.63 37.65,15.85 45.45,15.85 47.23,17.63 47.23,21.23 47.83,21.83 52.07,21.83 52.6,21.29 52.6,16.55 53.28,15.88 61.65,15.88 63.03,17.25 63.03,20.65 64.24,21.87 67.06,21.87 67.83,21.1 67.83,16.98 68.8,16 77.55,16 79.23,17.68 79.23,20.58 80.5,21.85 83.15,21.85 83.35,21.65 83.35,16.48 83.95,15.88 92.75,15.88 93.85,16.98 93.85,20.98 93.8,21.03 94.76,21.98
N41242 on Top Layer: 26.79,33.58 21.33,33.58 17.7,37.21 17.68,37.2 16.53,38.35 2.94,38.35 2.94,45.57 12.59,55.22 32.33,55.22 33.83,53.72 33.83,46.81 31.77,44.75 31.74,44.75 28.47,41.48 28.47,35.25
N62837 on Top Layer: 121.99,31.06 123.82,31.06 125.42,32.66 125.42,35.99 125.24,36.17 123.87,36.17 123.59,35.89 123.59,32.66 122.63,31.7 121.81,31.7 121.81,31.24

Small or netless copper shapes (teardrops, artwork), in the pictures only: 3 on Top Layer, 1 on Inner1

## Text on the board
Top Silkscreen Layer: Chaarger | IN BAT | 8 | POWER | 10 | 1 | 3 | 2 | GND | 5 | 7 | 9 | QV-601-Control | 4 | 6 | FAN2 | FAN1 | FAN4 | FAN3 | EXT BAT
